# EAGLE schematic PWM_controller_circuit (EAGLE 9.6.2)
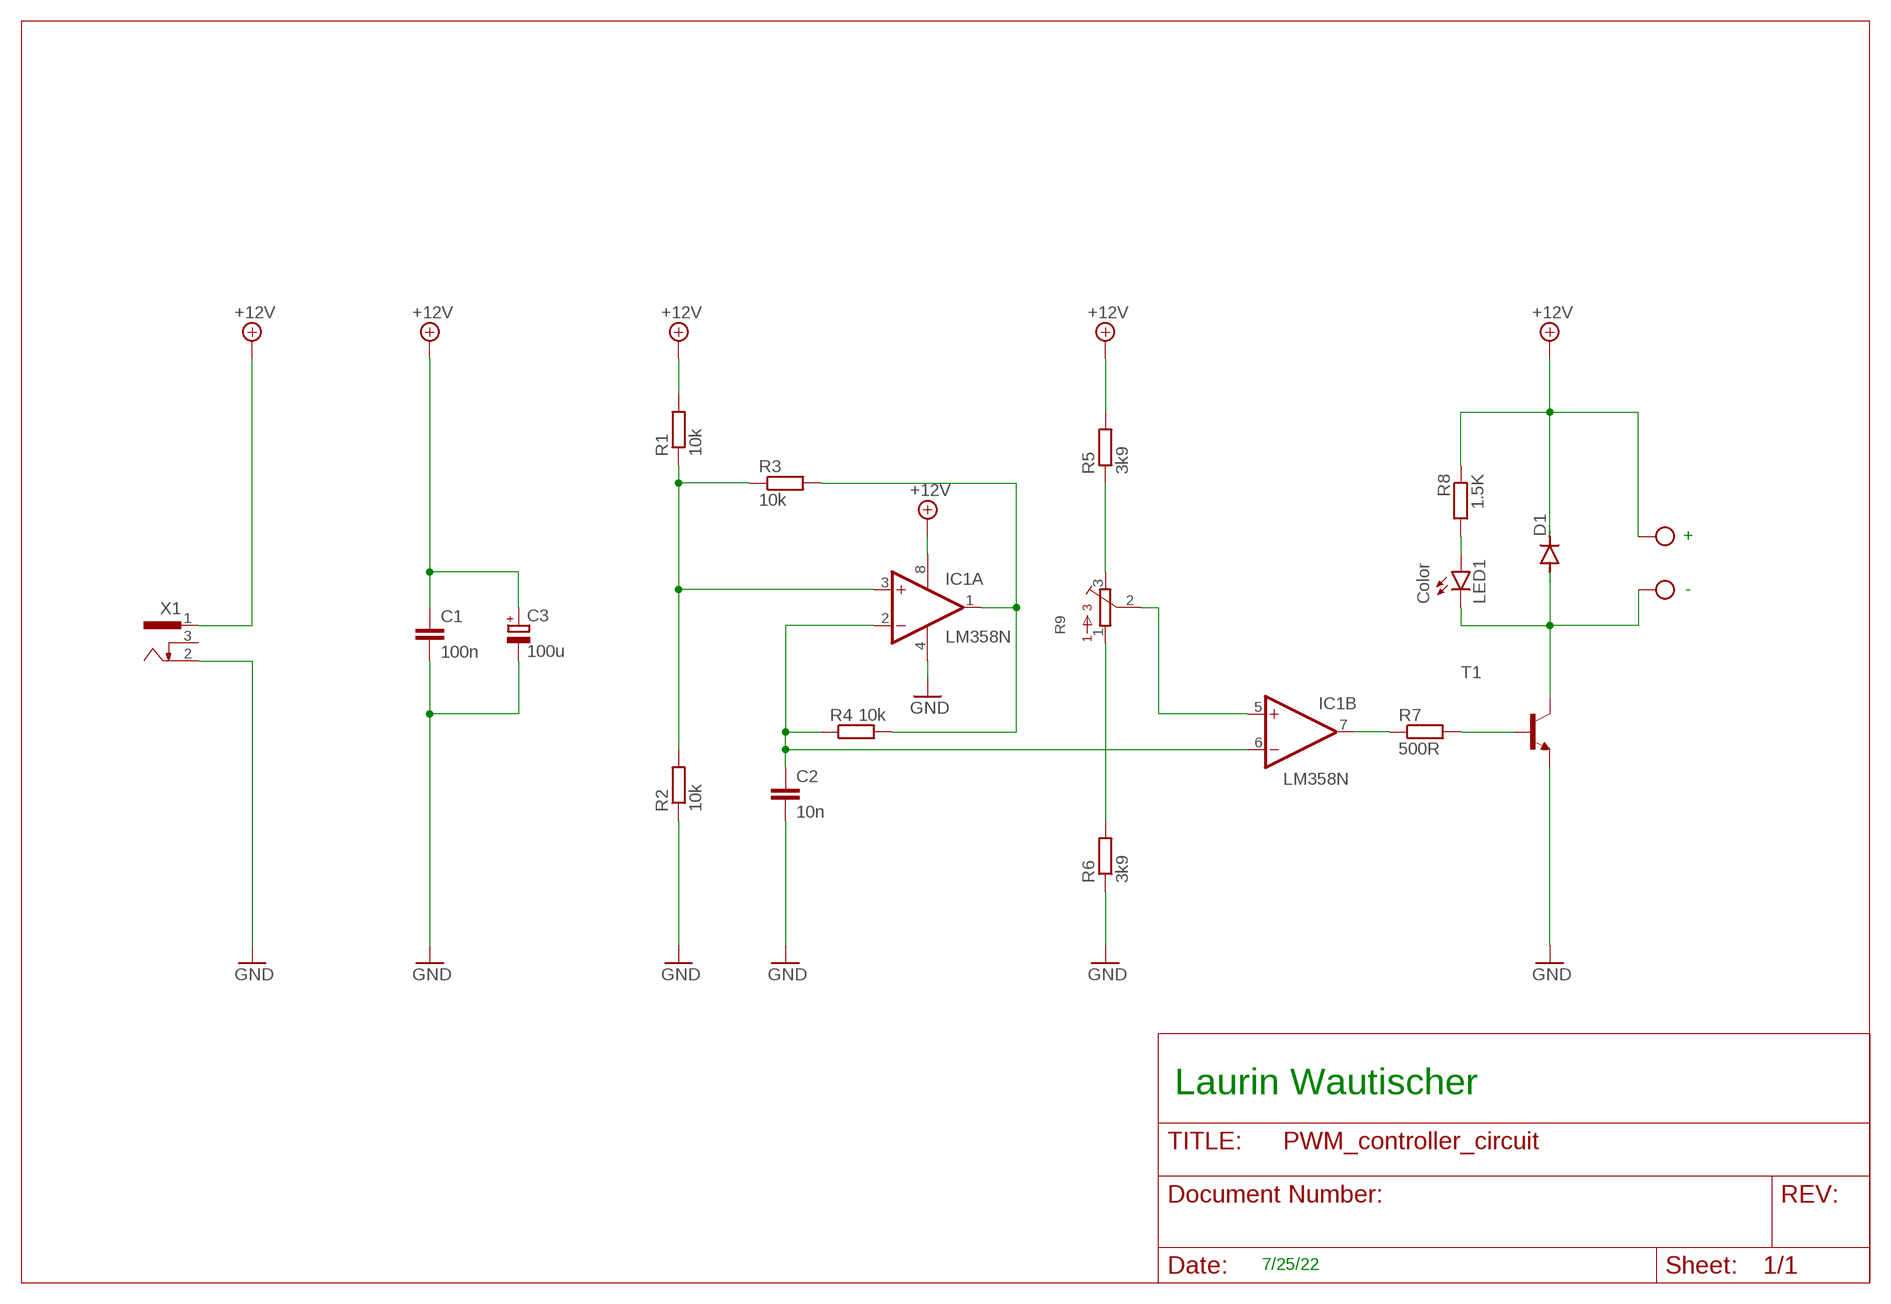
[diagram p0: schematic, sheet 1]

## Parts
C1  100n  C-EU050-030X075  [C050-030X075]
C2  10n  C-EU050-030X075  [C050-030X075]
C3  100u  CPOL-EUE5-6  [E5-6]
D1  1N4004  [DO41-10]
IC1  LM358N  [DIL08]
LED1  Color  LED3MM  [LED3MM]
R1  10k  R-EU_0207/10  [0207/10]
R2  10k  R-EU_0207/10  [0207/10]
R3  10k  R-EU_0207/10  [0207/10]
R4  10k  R-EU_0207/10  [0207/10]
R5  3k9  R-EU_0207/10  [0207/10]
R6  3k9  R-EU_0207/10  [0207/10]
R7  500R  R-EU_0207/10  [0207/10]
R8  1.5K  R-EU_0207/10  [0207/10]
R9  3386-F  [3386F]
T1  BC639-NPN-TO92-ECB  [TO92-ECB]
X1  733980-62  [733980-62]
X2  MKDSN1,5/2-5,08  [MKDSN1,5/2-5,08]

## Nets
+12V: C1.1 C3.+ D1.C IC1.8(P:V+) R1.2 R5.2 R8.1 X1.1 X2.2
GND: C1.2 C2.2 C3.- IC1.4(P:V-) R2.1 R6.1 T1.E X1.2
N$1: IC1.3(A:+IN) R1.1 R2.2 R3.1
N$2: C2.1 IC1.2(A:-IN) IC1.6(B:-IN) R4.1
N$3: IC1.1(A:OUT) R3.2 R4.2
N$4: R6.2 R9.1
N$5: IC1.7(B:OUT) R7.1
N$6: R7.2 T1.B
N$7: D1.A LED1.K(C) T1.C X2.1
N$8: IC1.5(B:+IN) R9.2
N$9: R5.1 R9.3
N$10: LED1.A R8.2
Unconnected: X1.3

## Notes on the sheet
- +
- -
- Laurin Wautischer
- 7/25/22

## Library data of the parts
C1 C2 = rcl:C-EU: CAPACITOR, European symbol; SPICEPREFIX: C
C3 = rcl:CPOL-EU: POLARIZED CAPACITOR, European symbol; SPICEPREFIX: C
D1 = diode:1N4004: DIODE general purpose rectifier, 1 A
IC1 = linear:LM358: OP AMP also LM158; LM258; LM2904 Source: http://cache.national.com/ds/LM/LM158.pdf
LED1 = led:LED: LED OSRAM: - CHIPLED LG R971, LG N971, LY N971, LG Q971, LY Q971, LO R971, LY R971 LH N974, LH R974 LS Q976, LO Q976, LY Q976 LO Q996 - Hyper CHIPLED LW Q18S LB Q993, LB Q99A, LB R99A - SideLED LS A670, LO A670, LY A670, LG A670, LP A670 LB A673, LV A673, LT A673, LW A673 LH A674 LY A675 LS A676, LA A676, LO A676, LY A676, LW A676 LS A679, LY A679, LG A679 - Hyper Micro SIDELEDÂ® LS Y876, LA Y876, LO Y876, LY Y876 LT Y87S - SmartLED LW L88C, LW L88S LB L89C, LB L89S, LG L890 LS L89K, LO L89K, LY L89K LS L896, LA L896, LO L896, LY L896 - TOPLED LS T670, LO T670, LY T670, LG T670, LP T670 LSG T670, LSP T670, LSY T670, LOP T670, LYG T670 LG T671, LOG T671, LSG T671 LB T673, LV T673, LT T673, LW T673 LH T674 LS T676, LA T676, LO T676, LY T676, LB T676, LH T676, LSB T676, LW T676 LB T67C, LV T67C, LT T67C, LS T67K, LO T67K, LY T67K, LW E67C LS E67B, LA E67B, LO E67B, LY E67B, LB E67C, LV E67C, LT E67C LW T67C LS T679, LY T679, LG T679 LS T770, LO T770, LY T770, LG T770, LP T770 LB T773, LV T773, LT T773, LW T773 LH T774 LS E675, LA E675, LY E675, LS T675 LS T776, LA T776, LO T776, LY T776, LB T776 LHGB T686 LT T68C, LB T68C - Hyper Mini TOPLEDÂ® LB M676 - Mini TOPLED SantanaÂ® LG M470 LS M47K, LO M47K, LY M47K Source: http://www.osram.convergy.de LUXEON: - LUMILEDÂ® LXK2-PW12-R00, LXK2-PW12-S00, LXK2-PW14-U00, LXK2-PW14-V00 LXK2-PM12-R00, LXK2-PM12-S00, LXK2-PM14-U00 LXK2-PE12-Q00, LXK2-PE12-R00, LXK2-PE12-S00, LXK2-PE14-T00, LXK2-PE14-U00 LXK2-PB12-K00, LXK2-PB12-L00, LXK2-PB12-M00, LXK2-PB14-N00, LXK2-PB14-P00, LXK2-PB14-Q00 LXK2-PR12-L00, LXK2-PR12-M00, LXK2-PR14-Q00, LXK2-PR14-R00 LXK2-PD12-Q00, LXK2-PD12-R00, LXK2-PD12-S00 LXK2-PH12-R00, LXK2-PH12-S00 LXK2-PL12-P00, LXK2-PL12-Q00, LXK2-PL12-R00 Source: www.luxeon.com KINGBRIGHT: KA-3528ASYC Source: www.kingbright.com
R1-R8 = rcl:R-EU_: RESISTOR, European symbol; SPICEPREFIX: R
R9 = bourns:3386-: 3386 Series 3/8" Square Trimmer
T1 = transistor:*-NPN-: NPN Transistror BF959 corrected 2008.03.06
X1 = con-conrad:73398?: FEMALE PRINT CONNECTOR Niedervolt-Steckverbinder Distributor Conrad
X2 = con-phoenix-508:MKDSN1,5/2-5,08: MKDSN 1,5/ 2-5,08 Printklemme Nennstrom: 13,5 A Nennspannung: 250 V RastermaÃŸ: 5,08 mm Polzahl: 2 Anschlussart: Schraubanschluss Montage: LÃ¶ten Anschlussrichtung Leiter/Platine: 0 Â° Artikelnummer: 1729128 Source: http://eshop.phoenixcontact.com .. 1729128.pdf